# Altium schematic sheet 12-digit-display.SchDoc
size A4
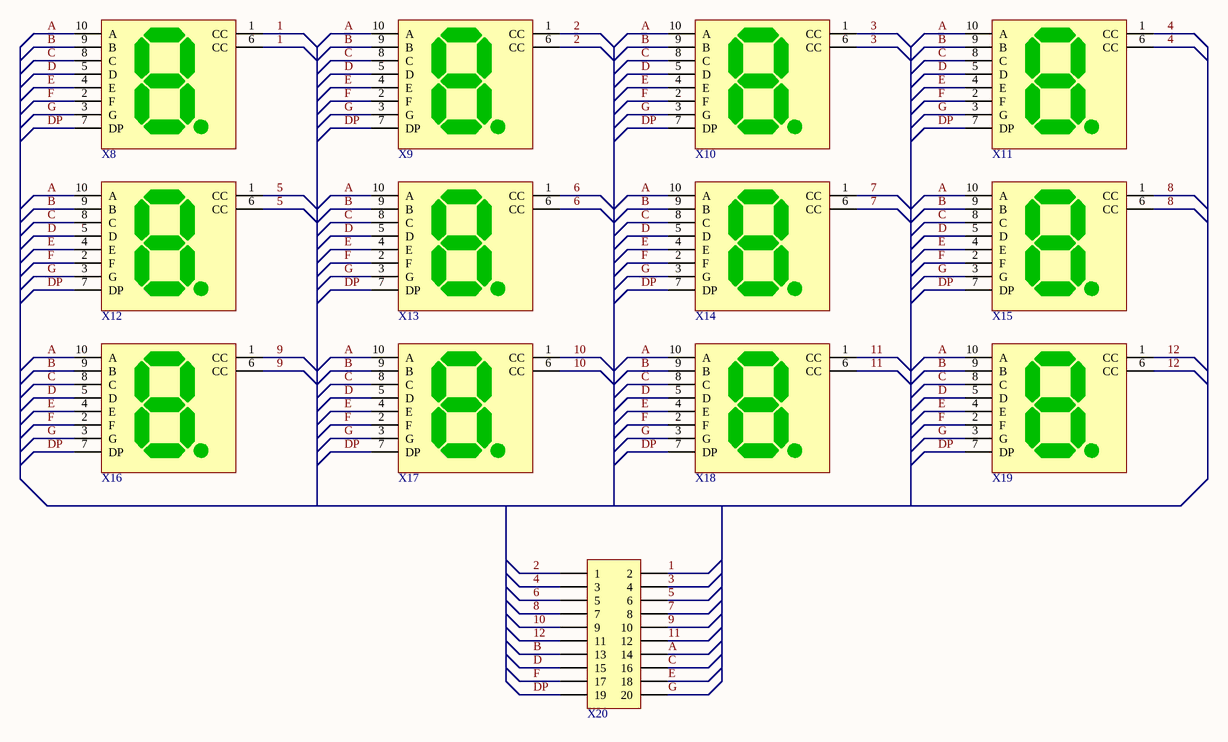
[diagram p0: 12-digit-display.SchDoc]

## Parts
X8  FYS-3912  [FYS-3916]  (value not drawn)
X9  FYS-3912  [FYS-3916]  (value not drawn)
X10  FYS-3912  [FYS-3916]  (value not drawn)
X11  FYS-3912  [FYS-3916]  (value not drawn)
X12  FYS-3912  [FYS-3916]  (value not drawn)
X13  FYS-3912  [FYS-3916]  (value not drawn)
X14  FYS-3912  [FYS-3916]  (value not drawn)
X15  FYS-3912  [FYS-3916]  (value not drawn)
X16  FYS-3912  [FYS-3916]  (value not drawn)
X17  FYS-3912  [FYS-3916]  (value not drawn)
X18  FYS-3912  [FYS-3916]  (value not drawn)
X19  FYS-3912  [FYS-3916]  (value not drawn)
X20  DIL-CONN-20  [DIL-CONN-IDC-20R]  (value not drawn)

## Nets
1: X8.1(CC) X8.6(CC) X20.2
2: X9.1(CC) X9.6(CC) X20.1
3: X10.1(CC) X10.6(CC) X20.4
4: X11.1(CC) X11.6(CC) X20.3
5: X12.1(CC) X12.6(CC) X20.6
6: X13.1(CC) X13.6(CC) X20.5
7: X14.1(CC) X14.6(CC) X20.8
8: X15.1(CC) X15.6(CC) X20.7
9: X16.1(CC) X16.6(CC) X20.10
10: X17.1(CC) X17.6(CC) X20.9
11: X18.1(CC) X18.6(CC) X20.12
12: X19.1(CC) X19.6(CC) X20.11
A: X8.10(A) X9.10(A) X10.10(A) X11.10(A) X12.10(A) X13.10(A) X14.10(A) X15.10(A) X16.10(A) X17.10(A) X18.10(A) X19.10(A) X20.14
B: X8.9(B) X9.9(B) X10.9(B) X11.9(B) X12.9(B) X13.9(B) X14.9(B) X15.9(B) X16.9(B) X17.9(B) X18.9(B) X19.9(B) X20.13
C: X8.8(C) X9.8(C) X10.8(C) X11.8(C) X12.8(C) X13.8(C) X14.8(C) X15.8(C) X16.8(C) X17.8(C) X18.8(C) X19.8(C) X20.16
D: X8.5(D) X9.5(D) X10.5(D) X11.5(D) X12.5(D) X13.5(D) X14.5(D) X15.5(D) X16.5(D) X17.5(D) X18.5(D) X19.5(D) X20.15
DP: X8.7(DP) X9.7(DP) X10.7(DP) X11.7(DP) X12.7(DP) X13.7(DP) X14.7(DP) X15.7(DP) X16.7(DP) X17.7(DP) X18.7(DP) X19.7(DP) X20.19
E: X8.4(E) X9.4(E) X10.4(E) X11.4(E) X12.4(E) X13.4(E) X14.4(E) X15.4(E) X16.4(E) X17.4(E) X18.4(E) X19.4(E) X20.18
F: X8.2(F) X9.2(F) X10.2(F) X11.2(F) X12.2(F) X13.2(F) X14.2(F) X15.2(F) X16.2(F) X17.2(F) X18.2(F) X19.2(F) X20.17
G: X8.3(G) X9.3(G) X10.3(G) X11.3(G) X12.3(G) X13.3(G) X14.3(G) X15.3(G) X16.3(G) X17.3(G) X18.3(G) X19.3(G) X20.20